# EAGLE design Mega2560_Grbl_to_RAMPS1-4_driver (EAGLE 6.3)
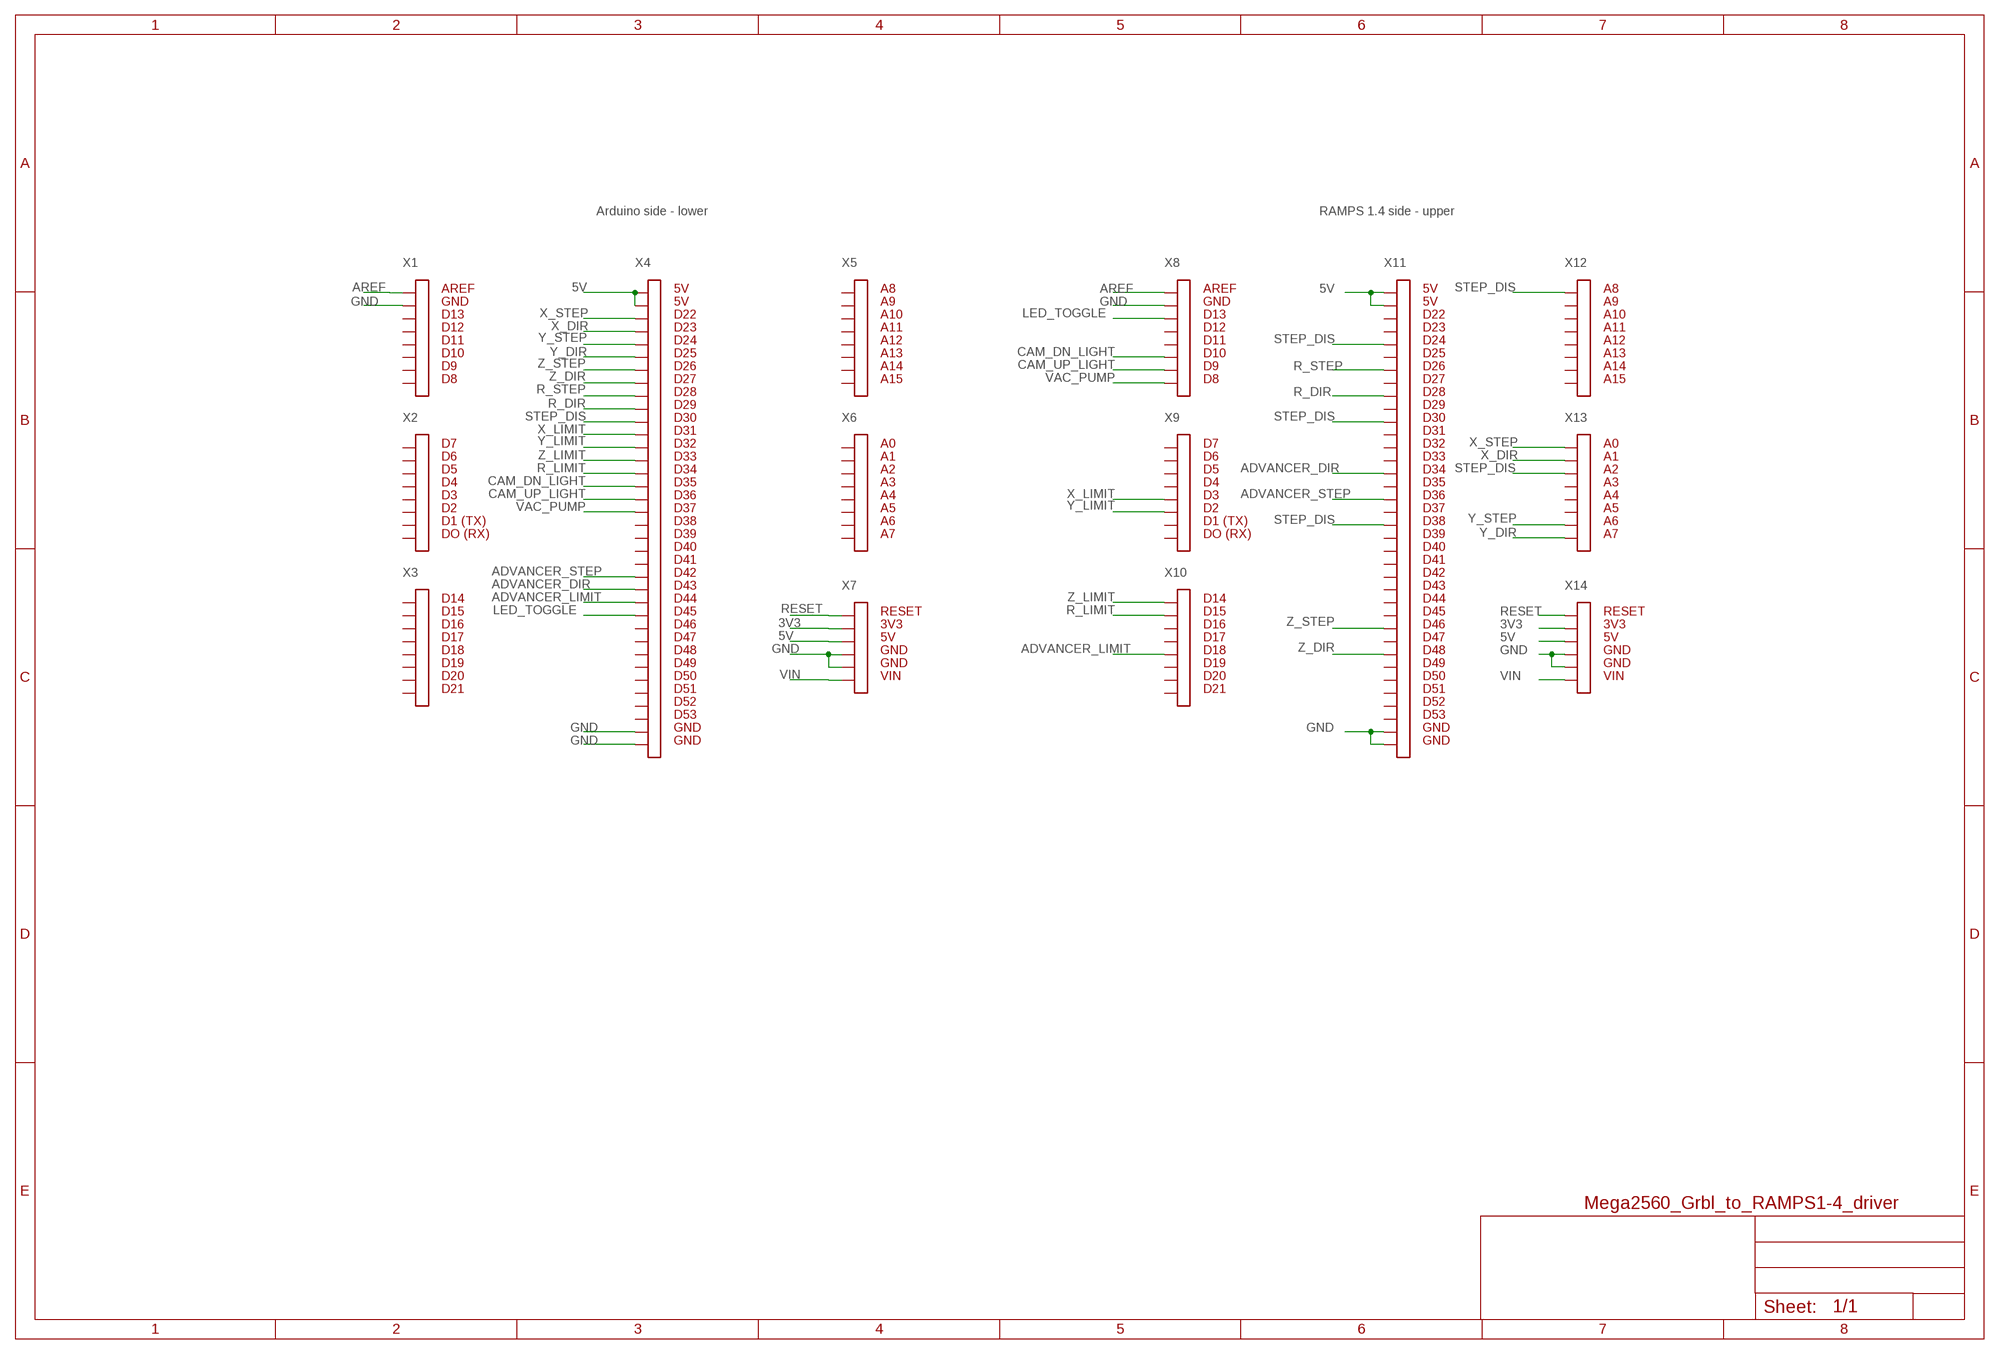
[diagram p0: schematic, sheet 1]

## Parts
X1  M20-9770842  [8X1-P2.54-D1.00]
X2  M20-9770842  [8X1-P2.54-D1.00]
X3  M20-9770842  [8X1-P2.54-D1.00]
X4  M20-9761842FLIP  [18X2-P2.54-D1.00]
X5  M20-9770842  [8X1-P2.54-D1.00]
X6  M20-9770842  [8X1-P2.54-D1.00]
X7  M20-9770642  [6X1-P2.54-D1.00]
X8  M20-7820842  [8X1-P2.54-D1.00]
X9  M20-7820842  [8X1-P2.54-D1.00]
X10  M20-7820842  [8X1-P2.54-D1.00]
X11  M20-7831842  [18X2-P2.54-D1.00]
X12  M20-7820842  [8X1-P2.54-D1.00]
X13  M20-7820842  [8X1-P2.54-D1.00]
X14  M20-7820642  [6X1-P2.54-D1.00]

## Nets
3V3: X7.P$2 X14.P$2
5V: X4.P$1 X4.P$2 X7.P$3 X11.P$1 X11.P$2 X14.P$3
ADVANCER_DIR: X4.P$23 X11.P$15
ADVANCER_LIMIT: X4.P$26 X10.P$5
ADVANCER_STEP: X4.P$24 X11.P$17
AREF: X1.P$1 X8.P$1
CAM_DN_LIGHT: X4.P$15 X8.P$6
CAM_UP_LIGHT: X4.P$18 X8.P$7
GND: X1.P$2 X4.P$35 X4.P$36 X7.P$4 X7.P$5 X8.P$2 X11.P$35 X11.P$36 X14.P$4 X14.P$5
LED_TOGGLE: X4.P$25 X8.P$3
R_DIR: X4.P$9 X11.P$9
R_LIMIT: X4.P$16 X10.P$2
R_STEP: X4.P$10 X11.P$7
RESET: X7.P$1 X14.P$1
STEP_DIS: X4.P$12 X11.P$5 X11.P$11 X11.P$19 X12.P$1 X13.P$3
VAC_PUMP: X4.P$17 X8.P$8
VIN: X7.P$6 X14.P$6
X_DIR: X4.P$3 X13.P$2
X_LIMIT: X4.P$11 X9.P$5
X_STEP: X4.P$4 X13.P$1
Y_DIR: X4.P$5 X13.P$8
Y_LIMIT: X4.P$14 X9.P$6
Y_STEP: X4.P$6 X13.P$7
Z_DIR: X4.P$7 X11.P$29
Z_LIMIT: X4.P$13 X10.P$1
Z_STEP: X4.P$8 X11.P$27
Unconnected: X1.P$3 X1.P$4 X1.P$5 X1.P$6 X1.P$7 X1.P$8 X2.P$1 X2.P$2 X2.P$3 X2.P$4 X2.P$5 X2.P$6 X2.P$7 X2.P$8 X3.P$1 X3.P$2 X3.P$3 X3.P$4 X3.P$5 X3.P$6 X3.P$7 X3.P$8 X4.P$19 X4.P$20 X4.P$21 X4.P$22 X4.P$27 X4.P$28 X4.P$29 X4.P$30 X4.P$31 X4.P$32 X4.P$33 X4.P$34 X5.P$1 X5.P$2 X5.P$3 X5.P$4 X5.P$5 X5.P$6 X5.P$7 X5.P$8 X6.P$1 X6.P$2 X6.P$3 X6.P$4 X6.P$5 X6.P$6 X6.P$7 X6.P$8 X8.P$4 X8.P$5 X9.P$1 X9.P$2 X9.P$3 X9.P$4 X9.P$7 X9.P$8 X10.P$3 X10.P$4 X10.P$6 X10.P$7 X10.P$8 X11.P$3 X11.P$4 X11.P$6 X11.P$8 X11.P$10 X11.P$12 X11.P$13 X11.P$14 X11.P$16 X11.P$18 X11.P$20 X11.P$21 X11.P$22 X11.P$23 X11.P$24 X11.P$25 X11.P$26 X11.P$28 X11.P$30 X11.P$31 X11.P$32 X11.P$33 X11.P$34 X12.P$2 X12.P$3 X12.P$4 X12.P$5 X12.P$6 X12.P$7 X12.P$8 X13.P$4 X13.P$5 X13.P$6

## Notes on the sheet
- Arduino side - lower | RAMPS 1.4 side - upper
- AREF | 5V | A8 | AREF | 5V | A8
- GND | 5V | A9 | GND | 5V | A9
- D13 | D22 | A10 | D13 | D22 | A10
- D12 | D23 | A11 | D12 | D23 | A11
- D11 | D24 | A12 | D11 | D24 | A12
- D10 | D25 | A13 | D10 | D25 | A13
- D9 | D26 | A14 | D9 | D26 | A14
- D8 | D27 | A15 | D8 | D27 | A15
- D28 | D28
- D29 | D29
- D30 | D30
- D31 | D31
- D7 | D32 | A0 | D7 | D32 | A0
- D6 | D33 | A1 | D6 | D33 | A1
- D5 | D34 | A2 | D5 | D34 | A2
- D4 | D35 | A3 | D4 | D35 | A3
- D3 | D36 | A4 | D3 | D36 | A4
- D2 | D37 | A5 | D2 | D37 | A5
- D1 (TX) | D38 | A6 | D1 (TX) | D38 | A6
- DO (RX) | D39 | A7 | DO (RX) | D39 | A7
- D40 | D40
- D41 | D41
- D42 | D42
- D43 | D43
- D14 | D44 | D14 | D44
- D15 | D45 | RESET | D15 | D45 | RESET
- D16 | D46 | 3V3 | D16 | D46 | 3V3
- D17 | D47 | 5V | D17 | D47 | 5V
- D18 | D48 | GND | D18 | D48 | GND
- D19 | D49 | GND | D19 | D49 | GND
- D20 | D50 | VIN | D20 | D50 | VIN
- D21 | D51 | D21 | D51
- D52 | D52
- D53 | D53
- GND | GND
- GND | GND

## Library data of the parts
X1-X3 X5 X6 = con-Harwin:M20-9770842
X4 = con-Harwin:M20-9761842
X7 = con-Harwin:M20-9770642
X8-X10 X12 X13 = con-Harwin:M20-7820842
X11 = con-Harwin:M20-7831842
X14 = con-Harwin:M20-7820642

## Board
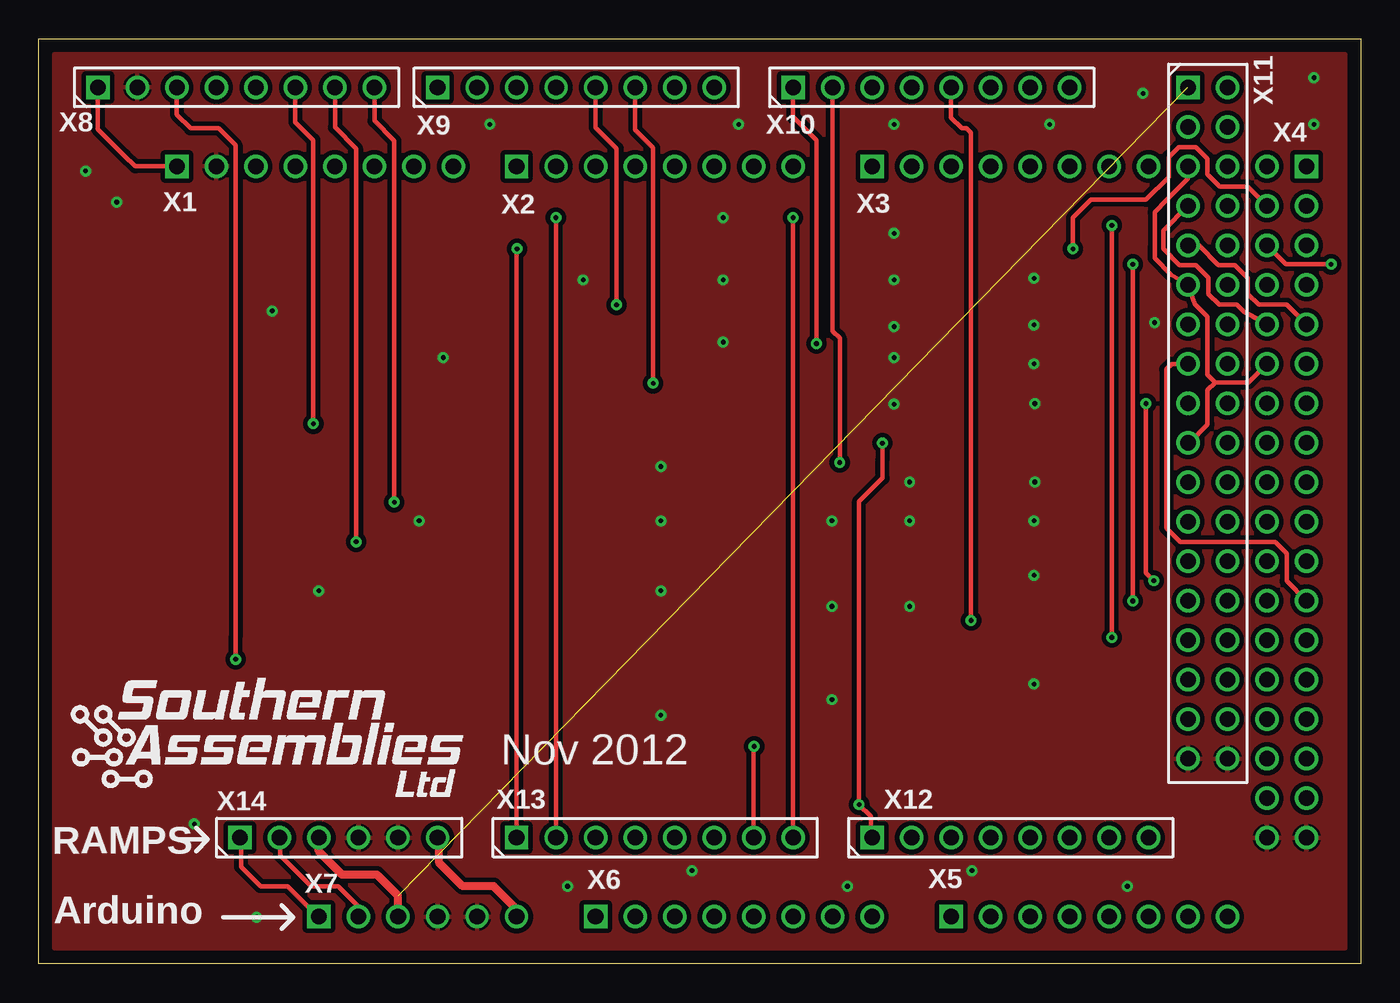
[diagram p1: board, top side]
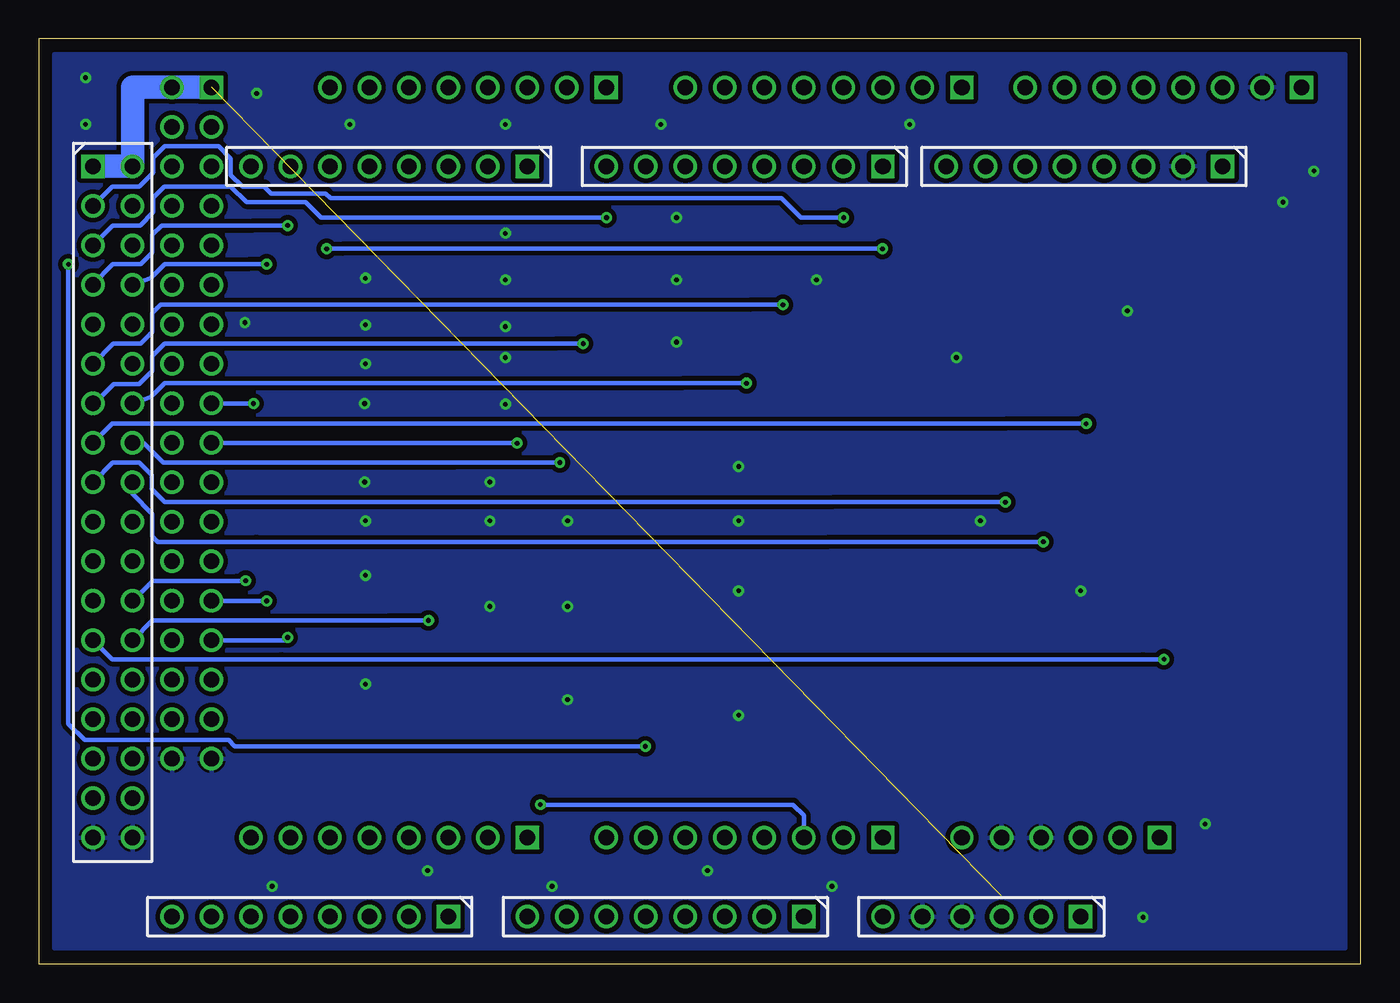
[diagram p2: board, bottom side, seen from below]

Size 85 x 59.5 mm. Coordinates in mm from the lower left corner, seen from the top.
Outline: 0,0 0,59.5 85,59.5 85,0 0,0
Copper layers (1*16): Top 0.035mm / dielectric 1.5mm / Bottom 0.035mm
Design rules "BetaLayout *": minimum track width 0.15mm, minimum drill 0.3mm, track to track 0.15mm, track to pad 0.15mm, pad to pad 0.15mm, via to via 0.15mm, smd to smd 0.15mm, copper to edge 0.5mm, drill to drill 0.5mm, minimum pad ring 10mil, minimum via ring 8mil, stop-mask expansion 4mil, vias tented up to drill 0mil, thermal gap 0.15mm

### Footprints (pad centres in the part's own frame; a part is rotated, then mirrored left to right if it is on the bottom)
8X1-P2.54-D1.00 = drill 1 square: P$1 0,0 | drill 1: P$2 2.54,0; P$3 5.08,0; P$4 7.62,0; P$5 10.16,0; P$6 12.7,0; P$7 15.24,0; P$8 17.78,0
18X2-P2.54-D1.00 = drill 1 square: P$1 0,0 | drill 1: P$2 0,2.54; P$3 2.54,0; P$4 2.54,2.54; P$5 5.08,0; P$6 5.08,2.54; P$7 7.62,0; P$8 7.62,2.54; P$9 10.16,0; P$10 10.16,2.54; P$11 12.7,0; P$12 12.7,2.54; P$13 15.24,0; P$14 15.24,2.54; P$15 17.78,0; P$16 17.78,2.54; P$17 20.32,0; P$18 20.32,2.54; P$19 22.86,0; P$20 22.86,2.54; P$21 25.4,0; P$22 25.4,2.54; P$23 27.94,0; P$24 27.94,2.54; P$25 30.48,0; P$26 30.48,2.54; P$27 33.02,0; P$28 33.02,2.54; P$29 35.56,0; P$30 35.56,2.54; P$31 38.1,0; P$32 38.1,2.54; P$33 40.64,0; P$34 40.64,2.54; P$35 43.18,0; P$36 43.18,2.54
6X1-P2.54-D1.00 = drill 1 square: P$1 0,0 | drill 1: P$2 2.54,0; P$3 5.08,0; P$4 7.62,0; P$5 10.16,0; P$6 12.7,0

### Placement (x,y rotation side)
X1  8.88,51.3 180 bottom
X2  30.72,51.3 180 bottom
X3  53.58,51.3 180 bottom
X4  81.52,51.3 270 bottom
X5  58.66,3.04 180 bottom
X6  35.8,3.04 180 bottom
X7  18.02,3.04 180 bottom
X8  3.8,56.38 0 top
X9  25.64,56.38 0 top
X10  48.5,56.38 0 top
X11  73.9,56.38 270 top
X12  53.58,8.12 0 top
X13  30.72,8.12 0 top
X14  12.94,8.12 0 top

### Tracks (layer width: path | path; a pad name or v marks a point on that pad's centre or on a via)
3V3
  Top 0.3: X7.P$2 20.56,3.69 19.25,5 17.5,5 15.5,7 15.5,8.1 X14.P$2
5V  (1 unrouted)
  Top 0.3: 18,8.1 X14.P$3 18,8.14
  Top 0.5: X7.P$3 23.1,3.4 23.1,4.4 21.75,5.75 19.5,5.75 18,7.25 18,8.1
  Bottom 1.5: X11.P$1 X11.P$2 78.98,56.38 X4.P$2 X4.P$1
ADVANCER_DIR
  Top 0.3: X11.P$15 72.85,38.6 72.5,38.25 72.5,28.05 73.4,27.15 79.5,27.15 80.25,26.4 80.25,24.63 X4.P$23
ADVANCER_LIMIT  (via drill 0.3)
  Top 0.3: X10.P$5 58.66,54.44 59.35,53.75 59.65,53.75 59.95,53.45 v59.95,22.1
  Bottom 0.3: X4.P$26 77.7,22.1 76.45,22.1 70.45,22.1 62.45,22.1 v59.95,22.1
ADVANCER_STEP  (via drill 0.3)
  Top 0.3: v71.2,36.05 71.2,25.95 71.2,25.15 v71.7,24.65
  Bottom 0.3: X4.P$24 77.69,24.65 76.3,24.65 72.25,24.65 v71.7,24.65 | X11.P$17 v71.21,36.06 v71.2,36.05
AREF
  Top 0.3: X8.P$1 3.8,53.7 5.5,52 6.2,51.3 X1.P$1
CAM_DN_LIGHT  (via drill 0.3)
  Top 0.3: X8.P$6 16.5,54.15 17.65,53 v17.65,34.75
  Bottom 0.3: X4.P$15 80.3,34.75 78.35,34.75 71.45,34.75 22.85,34.75 v17.65,34.75
CAM_UP_LIGHT  (via drill 0.3)
  Top 0.3: X8.P$7 19.04,53.81 20.4,52.45 v20.4,27.15
  Bottom 0.3: X4.P$18 79,30.96 79,30.25 77.7,28.95 77.7,28.4 77.7,27.5 77.35,27.15 71,27.15 34.2,27.15 v20.4,27.15
GND  (via drill 0.3)
  other vias: 71.75,41.25 64,18 51,17 40,16 40,24 18,24 24.45,28.5 15,42 26,39 29,54 40,32 40,28.5 44,40 44,44 44,48 35,44 45,54 55,54 65,54 71,56 82,57 82,54 55,47 55,44 55,41 55,39 55,36 56,31 56,28.5 56,23 51,23 51,28.5 34,5 42,6 52,5 60,6 70,5 14,3 10,9 3,51 5,49 64,25 64,28.5 64.05,31 64.05,36.05 64,38.6 64,41.1 64,44.1
  pour Bottom (isolate 0.3, rank 6): 1,1 1,58.5 84,58.5 84,1
  pour Top (isolate 0.3, rank 6): 1,1 1,58.5 84,58.5 84,1
LED_TOGGLE  (via drill 0.3)
  Top 0.3: X8.P$3 8.88,54.62 9.75,53.75 11.55,53.75 12.65,52.65 12.65,21 v12.65,19.6
  Bottom 0.3: X4.P$25 80.3,19.6 69.4,19.6 14,19.6 v12.65,19.6
R_DIR
  Top 0.3: X11.P$9 74.58,46.22 75.85,44.95 76.9,44.95 77.75,44.1 77.75,43.1 78.45,42.4 80.26,42.4 X4.P$9
R_LIMIT  (via drill 0.3)
  Top 0.3: X10.P$2 51.04,40.71 51.5,40.25 v51.5,32.25
  Bottom 0.3: X4.P$16 78.27,33.52 77,32.25 71.15,32.25 58.3,32.25 v51.5,32.25
R_STEP
  Top 0.3: X11.P$7 72.3,47.16 72.3,46 73.35,44.95 74.4,44.95 75.2,44.15 75.2,43.1 75.9,42.4 76.45,42.4 76.77,42.4 77.05,42.4 77.5,41.95 X4.P$10
RESET
  Top 0.3: X7.P$1 17.96,3.04 16,5 14.25,5 13,6.25 13,8.06 X14.P$1
STEP_DIS  (via drill 0.3)
  Top 0.3: X11.P$19 73.97,33.52 75.15,34.7 75.15,36.9 75.65,37.4 | 75.65,37.4 77.78,37.4 X4.P$12 | 75.65,37.4 75.15,37.9 75.15,38.6 75.15,41.18 75.15,41.65 74.35,42.45 X11.P$11 | X11.P$11 73.9,43.7 | v54.25,33.5 54.25,32.5 54.25,31.25 52.75,29.75 v52.75,10.25 53.5,9.5 53.5,8.2 X12.P$1 | X11.P$5 73.9,50.5 72.55,49.15 71.75,48.35 71.75,46.1 71.75,45.83 71.75,45.4 72.8,44.35 X11.P$11
  Bottom 0.3: X13.P$3 35.8,9.55 36.5,10.25 v52.75,10.25 | X11.P$19 54.27,33.52 v54.25,33.5
VAC_PUMP  (via drill 0.3)
  Top 0.3: X8.P$8 21.58,54.22 22.8,53 22.85,52.95 v22.85,29.7
  Bottom 0.3: X4.P$17 80.25,32.25 78.55,32.25 77.75,31.45 77.75,30.55 76.9,29.7 74.65,29.7 71.3,29.7 34,29.7 v22.85,29.7
VIN
  Top 0.5: X7.P$6 30.72,3.53 29.25,5 27.25,5 25.75,6.5 25.75,8.01 X14.P$6
X_DIR  (via drill 0.3)
  Top 0.3: X13.P$2 v33.26,47.99 v33.25,48
  Bottom 0.3: X4.P$3 81.52,48.78 80.3,50 78.55,50 77.65,50.9 77.65,51.85 76.9,52.6 73.45,52.6 72.65,51.8 72.65,50.75 71.9,50 70.5,50 70.05,49.55 67.95,49.55 66.55,49.55 66.25,49.25 37.25,49.25 36,48 v33.25,48
X_LIMIT  (via drill 0.3)
  Top 0.3: X9.P$5 35.8,53.8 37.15,52.45 v37.15,42.4
  Bottom 0.3: X4.P$11 80.22,39.9 79,39.9 78.45,39.9 77.7,40.65 77.7,41.85 77.15,42.4 70.55,42.4 39.3,42.4 v37.15,42.4
X_STEP  (via drill 0.3)
  Top 0.3: X13.P$1 30.72,45.97 v30.75,46 | X4.P$4 77.75,50 75.95,50 75.15,50.8 75.15,51.8 74.4,52.55 73.3,52.55 72.65,51.9 72.65,50.6 71.2,49.15 67.65,49.15 66.5,48 66.5,46.75 v66.5,46
  Bottom 0.3: v30.75,46 65.5,46 v66.5,46
Y_DIR  (via drill 0.3)
  Top 0.3: X13.P$8 v48.5,48
  Bottom 0.3: X4.P$5 80.25,47.5 78.5,47.5 77.65,48.35 77.65,49.3 76.95,50 72.65,50 71.65,49 67.85,49 66.85,48 v48.5,48
Y_LIMIT  (via drill 0.3)
  Top 0.3: X9.P$6 38.34,53.66 39.5,52.5 v39.5,37.35
  Bottom 0.3: X4.P$14 77.8,36.45 76.9,37.35 76.45,37.35 70.7,37.35 43.65,37.35 v39.5,37.35
Y_STEP  (via drill 0.3)
  Top 0.3: X13.P$7 45.96,13.96 v46,14 | v83.1,45 80.2,45 X4.P$6
  Bottom 0.3: v46,14 72.4,14 72.8,14.4 82.05,14.4 83.1,15.45 v83.1,45
Z_DIR  (via drill 0.3)
  Top 0.3: v69,21 v69,47.5
  Bottom 0.3: X4.P$7 81.52,43.73 80.25,45 78.45,45 77.7,45.75 77.7,46.9 77.1,47.5 71.2,47.5 v69,47.5 | X11.P$29 69.18,20.82 v69,21
Z_LIMIT  (via drill 0.3)
  Top 0.3: X10.P$1 48.5,54.5 50,53 v50,39.9
  Bottom 0.3: X4.P$13 81.44,36.06 80.2,37.3 78.55,37.3 77.7,38.15 77.7,39.1 76.9,39.9 70.8,39.9 51.8,39.9 v50,39.9
Z_STEP  (via drill 0.3)
  Top 0.3: v70.35,23.35 70.35,44 v70.35,45
  Bottom 0.3: X4.P$8 77.8,44.1 76.9,45 76.5,45 71.55,45 v70.35,45 | v70.35,23.35 X11.P$27

### Text on the board
tPlace: Nov 2012 | RAMPS | Arduino